# Altium schematic sheet sens_adc.SchDoc
size A
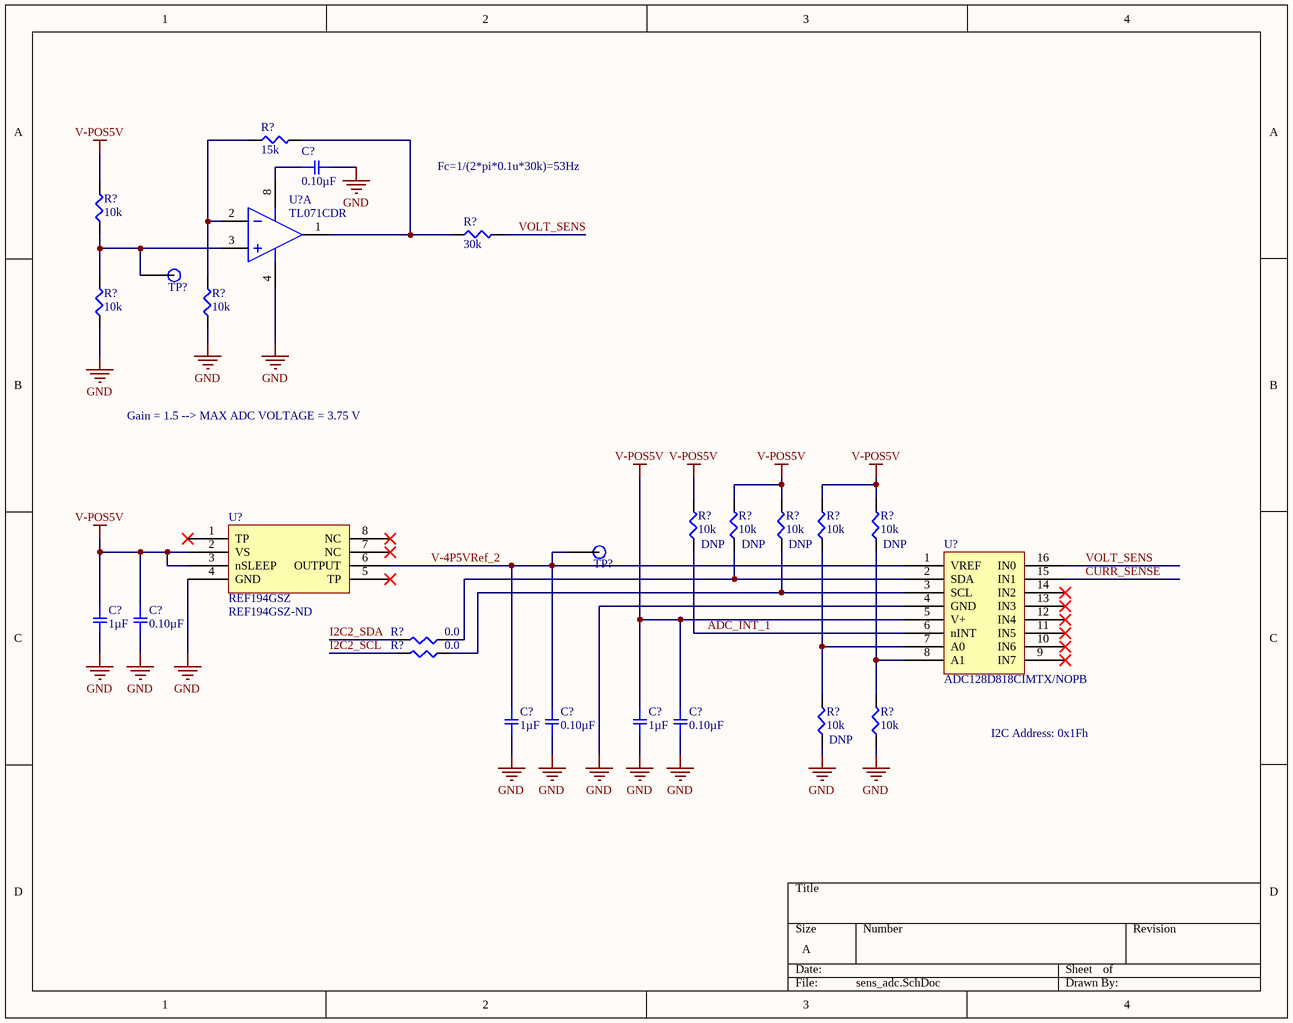
[diagram p0: sens_adc.SchDoc]

## Parts
(Parts that share a designator on the sheet are numbered #1, #2 ... from top to bottom, then left to right.)
C?#1  0.10µF  [SMD-0805C]
C?#2  1µF  [SMD-0805C]
C?#3  0.10µF  [SMD-0805C]
C?#4  1µF  [SMD-0805C]
C?#5  0.10µF  [SMD-0805C]
C?#6  1µF  [SMD-0805C]
C?#7  0.10µF  [SMD-0805C]
R?#1  15k  [SMD-0805-RES]
R?#2  10k  [SMD-0805-RES]
R?#3  30k  [SMD-0805-RES]
R?#4  10k  [SMD-0805-RES]
R?#5  10k  [SMD-0805-RES]
R?#6  10k  [SMD-0805-RES]
R?#7  10k  [SMD-0805-RES]
R?#8  10k  [SMD-0805-RES]
R?#9  10k  [SMD-0805-RES]
R?#10  10k  [SMD-0805-RES]
R?#11  0.0  [SMD-0805-RES]
R?#12  0.0  [SMD-0805-RES]
R?#13  10k  [SMD-0805-RES]
R?#14  10k  [SMD-0805-RES]
TP?#1  TP  [Test Point]  (value not drawn)
TP?#2  TP  [Test Point]  (value not drawn)
U?#1  TL071CDR  [SOP127P600X175-8N]  (part A of 2)
U?#2  REF194GSZ  Supplier Part Number 1: REF194GSZ-ND  [SOP127P600X175-8N]
U?#3  ADC128D818CIMTX/NOPB  [TSOP65P660X120-16N]

## Nets
GND: C?#1.2 C?#2.2 C?#3.2 C?#4.2 C?#5.2 C?#6.2 C?#7.2 R?#4.1 R?#5.1 R?#13.1 R?#14.1 U?#1.4(V-) U?#2.4(GND) U?#3.4(GND)
V-POS5V: C?#2.1 C?#3.1 C?#6.1 C?#7.1 R?#2.2 R?#6.2 R?#7.2 R?#8.2 R?#9.2 R?#10.2 U?#2.2(VS) U?#2.3(nSLEEP) U?#3.5(V+)
ADC_INT_1: R?#6.1 U?#3.6(nINT)
CURR_SENSE: U?#3.15(IN1)
I2C2_SCL: R?#12.2
I2C2_SDA: R?#11.2
V-4P5VRef_2: C?#4.1 C?#5.1 TP?#2.1 U?#2.6(OUTPUT) U?#3.1(VREF)
VOLT_SENS: R?#3.2 U?#3.16(IN0)
NetC?#1_1: C?#1.1 U?#1.8(V+)
NetR?#1_1: R?#1.1 R?#5.2 U?#1.2(IN-)
NetR?#1_2: R?#1.2 R?#3.1 U?#1.1(OUT)
NetR?#2_1: R?#2.1 R?#4.2 TP?#1.1 U?#1.3(IN+)
NetR?#7_1: R?#7.1 R?#11.1 U?#3.2(SDA)
NetR?#8_1: R?#8.1 R?#12.1 U?#3.3(SCL)
NetR?#9_1: R?#9.1 R?#13.2 U?#3.7(A0)
NetR?#10_1: R?#10.1 R?#14.2 U?#3.8(A1)

Not connected (* = marked no-connect by the designer): U?#2 1(TP)* 5(TP)* 7(NC)* 8(NC)*; U?#3 9(IN7)* 10(IN6)* 11(IN5)* 12(IN4)* 13(IN3)* 14(IN2)*

## Notes on the sheet
- Fc=1/(2*pi*0.1u*30k)=53Hz
- Gain = 1.5 --> MAX ADC VOLTAGE = 3.75 V
- I2C Address: 0x1Fh

## Library data of the parts
C?#1 = GRM21B7U1A104JA01L: CAP CER 0.1UF 10V U2J 0805; Manufacturer: Murata Electronics North America; Factory Stock: 0; Unit Price (USD): 0.4; Minimum Quantity: 1; Tolerance: ±5%; Datasheets: http://www.murata.com/~/media/webrenewal/support/library/catalog/products/capacitor/mlcc/c02e.pdf; Image: //media.digikey.com/Renders/Murata%20Renders/0805%20(2012%20Metric)%20.85mm.jpg; Digi-Key Part Number: 490-11592-1-ND; Part Number: GRM21B7U1A104JA01L; Quantity Available: 3390; @ qty: 0; Packaging: Cut Tape (CT); Series: GRM; Part Status: Active; Value: 0.10µF; Voltage: 10V; Temperature Coefficient: U2J; Operating Temperature: -55°C ~ 125°C; Features: -; Ratings: -; Applications: General Purpose; Mounting Type: Surface Mount, MLCC; Package / Case: 0805 (2012 Metric); Size / Dimension: 0.079" L x 0.049" W (2.00mm x 1.25mm); Height - Seated (Max): -; Thickness (Max): 0.053" (1.35mm); Lead Spacing: -; Lead Style: -
C?#2 C?#4 C?#6 = GRM21BR71H105KA12L: CAP CER 1UF 50V X7R 0805; Manufacturer: Murata Electronics North America; Factory Stock: 0; Unit Price (USD): 0.25; Minimum Quantity: 1; Tolerance: ±10%; Datasheets: http://www.murata.com/~/media/webrenewal/support/library/catalog/products/capacitor/mlcc/c02e.pdf; Image: //media.digikey.com/Renders/Murata%20Renders/0805%20(2012%20Metric)%20.85mm.jpg; Digi-Key Part Number: 490-4736-1-ND; Part Number: GRM21BR71H105KA12L; Quantity Available: 988032; @ qty: 0; Packaging: Cut Tape (CT); Series: GRM; Part Status: Active; Value: 1µF; Voltage: 50V; Temperature Coefficient: X7R; Operating Temperature: -55°C ~ 125°C; Features: -; Ratings: -; Applications: General Purpose; Mounting Type: Surface Mount, MLCC; Package / Case: 0805 (2012 Metric); Size / Dimension: 0.079" L x 0.049" W (2.00mm x 1.25mm); Height - Seated (Max): -; Thickness (Max): 0.053" (1.35mm); Lead Spacing: -; Lead Style: -
C?#3 C?#5 C?#7 = GCD21BR71H104KA01L: CAP CER 0.1UF 50V X7R 0805; Manufacturer: Murata Electronics North America; Factory Stock: 0; Unit Price (USD): 0.24; Minimum Quantity: 1; Tolerance: ±10%; Datasheets: http://www.murata.com/~/media/webrenewal/support/library/catalog/products/capacitor/mlcc/c03e.ashx; Image: //media.digikey.com/Renders/Murata%20Renders/0805%28GxM6%29.jpg; Digi-Key Part Number: 490-11955-1-ND; Part Number: GCD21BR71H104KA01L; Quantity Available: 157; @ qty: 0; Packaging: Cut Tape (CT); Series: GCD; Part Status: Active; Value: 0.10µF; Voltage: 50V; Temperature Coefficient: X7R; Operating Temperature: -55°C ~ 125°C; Features: -; Ratings: AEC-Q200; Applications: Automotive; Mounting Type: Surface Mount, MLCC; Package / Case: 0805 (2012 Metric); Size / Dimension: 0.079" L x 0.049" W (2.00mm x 1.25mm); Height - Seated (Max): -; Thickness (Max): 0.049" (1.25mm); Lead Spacing: -; Lead Style: -
R?#1 = ERJ-P06J153V: RES SMD 15K OHM 5% 1/2W 0805; Manufacturer: Panasonic Electronic Components; Factory Stock: 0; Unit Price (USD): 0.01839; @ qty: 1500; Minimum Quantity: 1; Power (Watts): 0.5W, 1/2W; Temperature Coefficient: ±200ppm/°C; Part Number: ERJ-P06J153V; Datasheets: https://industrial.panasonic.com/cdbs/www-data/pdf/RDA0000/AOA0000C243.pdf; Image: //media.digikey.com/Renders/Panasonic%20Renders/ERJ-0805%20Pkg.jpg; Digi-Key Part Number: P15KADCT-ND; Quantity Available: 18476; Packaging: Cut Tape (CT); Series: ERJ; Part Status: Active; Value: 15k; Tolerance: ±5%; Composition: Thick Film; Features: Automotive AEC-Q200, Pulse Withstanding; Operating Temperature: -55°C ~ 155°C; Package / Case: 0805 (2012 Metric); Supplier Device Package: 0805; Size / Dimension: 0.079" L x 0.049" W (2.00mm x 1.25mm); Height - Seated (Max): 0.028" (0.70mm); Number of Terminations: 2; Failure Rate: -
R?#2 R?#4-R?#10 R?#13 R?#14 = ERJ-P06J103V: RES SMD 10K OHM 5% 1/2W 0805; Manufacturer: Panasonic Electronic Components; Factory Stock: 0; Unit Price (USD): 0.01839; @ qty: 1500; Minimum Quantity: 1; Power (Watts): 0.5W, 1/2W; Temperature Coefficient: ±200ppm/°C; Part Number: ERJ-P06J103V; Datasheets: https://industrial.panasonic.com/cdbs/www-data/pdf/RDA0000/AOA0000C243.pdf; Image: //media.digikey.com/Renders/Panasonic%20Renders/ERJ-0805%20Pkg.jpg; Digi-Key Part Number: P10KADCT-ND; Quantity Available: 413576; Packaging: Cut Tape (CT); Series: ERJ; Part Status: Active; Value: 10k; Tolerance: ±5%; Composition: Thick Film; Features: Automotive AEC-Q200, Pulse Withstanding; Operating Temperature: -55°C ~ 155°C; Package / Case: 0805 (2012 Metric); Supplier Device Package: 0805; Size / Dimension: 0.079" L x 0.049" W (2.00mm x 1.25mm); Height - Seated (Max): 0.028" (0.70mm); Number of Terminations: 2; Failure Rate: -
  R?#6-R?#8 R?#10 R?#13: DNP: DNP
R?#3 = ERJ-P06J303V: RES SMD 30K OHM 5% 1/2W 0805; Manufacturer: Panasonic Electronic Components; Factory Stock: 0; Unit Price (USD): 0.01839; @ qty: 1500; Minimum Quantity: 1; Power (Watts): 0.5W, 1/2W; Temperature Coefficient: ±200ppm/°C; Part Number: ERJ-P06J303V; Datasheets: https://industrial.panasonic.com/cdbs/www-data/pdf/RDA0000/AOA0000C243.pdf; Image: //media.digikey.com/Renders/Panasonic%20Renders/ERJ-0805%20Pkg.jpg; Digi-Key Part Number: P30KADCT-ND; Quantity Available: 7773; Packaging: Cut Tape (CT); Series: ERJ; Part Status: Active; Value: 30k; Tolerance: ±5%; Composition: Thick Film; Features: Automotive AEC-Q200, Pulse Withstanding; Operating Temperature: -55°C ~ 155°C; Package / Case: 0805 (2012 Metric); Supplier Device Package: 0805; Size / Dimension: 0.079" L x 0.049" W (2.00mm x 1.25mm); Height - Seated (Max): 0.028" (0.70mm); Number of Terminations: 2; Failure Rate: -
R?#11 R?#12 = ERJ-6GEY0R00V: RES SMD 0.0 OHM JUMPER 1/8W 0805; Manufacturer: Panasonic Electronic Components; Factory Stock: 0; Unit Price (USD): 0.00544; @ qty: 1500; Minimum Quantity: 1; Power (Watts): 0.125W, 1/8W; Part Number: ERJ-6GEY0R00V; Datasheets: http://industrial.panasonic.com/www-cgi/jvcr13pz.cgi?E+PZ+3+AOA0001+ERJ6GEY0R00V+7+WW; Image: //media.digikey.com/Renders/Panasonic%20Renders/ERJ-0805%20Pkg.jpg; Digi-Key Part Number: P0.0ACT-ND; Quantity Available: 1597627; Packaging: Cut Tape (CT); Series: ERJ; Part Status: Active; Value: 0.0; Tolerance: Jumper; Composition: Thick Film; Features: Automotive AEC-Q200; Temperature Coefficient: -; Operating Temperature: -55°C ~ 155°C; Package / Case: 0805 (2012 Metric); Supplier Device Package: 0805; Size / Dimension: 0.079" L x 0.049" W (2.00mm x 1.25mm); Height - Seated (Max): 0.028" (0.70mm); Number of Terminations: 2; Failure Rate: -
TP?#1 TP?#2 = TP: SMD TEST POINT
U?#1 = TL071CDR: IC OPAMP JFET 3MHZ 8SOIC; Manufacturer: Texas Instruments; Max Dual Supply Voltage: 18V; Voltage Gain: 106.02dB; Common Mode Rejection Ratio: 70dB; Slew Rate: 13V/µs; Input Offset Voltage (Vos): 10mV; Input Bias Current: 200pA; Number of Elements: 1; Nominal Supply Current: 2.5mA; Min Dual Supply Voltage: 3.5V; Operating Supply Current: 1.4mA; Dual Supply Voltage: 9V; Supplier 1: Digi-Key; Manufacturer Part Number: TL071CDR; Stock 1: 8447; Pricing 1: 1=0.47000, 10=0.40200, 100=0.29990, 500=0.23566, 1000=0.18210 (USD); RoHS: Yes; Case/Package: D; Number of Pins: 8; Contact Plating: Gold; Min Operating Temperature: -40°C; Max Operating Temperature: 85°C; Packaging: Tape and Reel; Unity Gain Bandwidth Product: 3MHz; Bandwidth: 3MHz; Package Quantity: 1; Nominal Gain Bandwidth Product: 3MHz; Number of Channels: 1; Max I/O Voltage: 10mV; Gain Bandwidth Product: 3MHz; Number of Circuits: 1; Max Supply Voltage: 18V; Number of Amplifiers: 1; Length: 4.9mm; Height: 1.58mm; Width: 3.91mm; Radiation Hardening: No; Lead Free: Lead Free; REACH SVHC: No SVHC; ComponentLink1URL: https://datasheet.ciiva.com/46439/1835036-46439448.pdf?src-supplier=Element14; ComponentLink1Description: https://datasheet.ciiva.com/46439/1835036-46439448.pdf?src-supplier=Element14; ComponentLink2URL: https://datasheet.ciiva.com/1795/tl071a-1795709.pdf?src-supplier=Digi-Key; ComponentLink2Description: https://datasheet.ciiva.com/1795/tl071a-1795709.pdf?src-supplier=Digi-Key; ComponentLink3URL: https://datasheet.ciiva.com/14456/tl074-14456719.pdf?src-supplier=Avnet; ComponentLink3Description: https://datasheet.ciiva.com/14456/tl074-14456719.pdf?src-supplier=Avnet; ComponentLink4URL: https://datasheet.ciiva.com/26243/tl074-26243627.pdf?src-supplier=Avnet+Europe; ComponentLink4Description: https://datasheet.ciiva.com/26243/tl074-26243627.pdf?src-supplier=Avnet+Europe; ComponentLink5URL: https://datasheet.ciiva.com/1795/tl071a-1795710.pdf?src-supplier=Digi-Key; ComponentLink5Description: https://datasheet.ciiva.com/1795/tl071a-1795710.pdf?src-supplier=Digi-Key; ComponentLink6URL: https://datasheet.ciiva.com/1795/tl071a-1795711.pdf?src-supplier=Digi-Key; ComponentLink6Description: https://datasheet.ciiva.com/1795/tl071a-1795711.pdf?src-supplier=Digi-Key; Supplier Part Number 1: 296-14994-1-ND
U?#2 = REF194GSZ: IC VREF SERIES 4.5V 8SOIC; Manufacturer: Analog Devices; Max Input Voltage: 18V; Max Output Current: 30mA; Temperature Coefficient: 25ppm/°C; Number of Channels: 1; Min Output Voltage: 4.49V; Operating Supply Current: 45uA; Quiescent Current: 15uA; Min Input Voltage: 4.75V; Supplier 1: Digi-Key; Manufacturer Part Number: REF194GSZ; Stock 1: 359; Pricing 1: 1=3.56000, 10=3.19700, 25=3.02240, 100=2.61940, 250=2.48512, 500=2.22988, 1000=1.88062, 2500=1.78659 (USD); RoHS: Yes; Case/Package: R; Number of Pins: 8; Min Operating Temperature: -40°C; Max Operating Temperature: 85°C; Output Voltage: 4.5V; Packaging: Rail/Tube; Output Current: 30mA; Max Output Voltage: 4.5V; Reference Type: Series; Package Quantity: 98; Nominal Supply Current: 45uA; Reference Voltage: 4.5V; Length: 5mm; Height: 1.5mm; Width: 4mm; Radiation Hardening: No; Lead Free: Contains Lead; REACH SVHC: No SVHC; ComponentLink1URL: https://datasheet.ciiva.com/17219/ref19xseries-17219157.pdf?src-supplier=Avnet+Europe; ComponentLink1Description: https://datasheet.ciiva.com/17219/ref19xseries-17219157.pdf?src-supplier=Avnet+Europe; ComponentLink2URL: https://datasheet.ciiva.com/22666/1506113-22666153.pdf?src-supplier=Element14; ComponentLink2Description: https://datasheet.ciiva.com/22666/1506113-22666153.pdf?src-supplier=Element14; ComponentLink3URL: https://datasheet.ciiva.com/2005/ref19xseries-2005902.pdf?src-supplier=Digi-Key; ComponentLink3Description: https://datasheet.ciiva.com/2005/ref19xseries-2005902.pdf?src-supplier=Digi-Key; ComponentLink4URL: https://datasheet.ciiva.com/3235/ref19xseries-3235518.pdf?src-supplier=Avnet; ComponentLink4Description: https://datasheet.ciiva.com/3235/ref19xseries-3235518.pdf?src-supplier=Avnet
U?#3 = ADC128D818CIMTX/NOPB: Analog to Digital Converters - ADC; Manufacturer: TI National Semiconductor; Resolution: 12b; Sampling Rate: 10000S/s; Number of A/D Converters: 1; Polarity: Unipolar; Max Supply Voltage: 5.5V; Min Supply Voltage: 3V; Interface: I2C; Number of Channels: 8; Max Power Dissipation: 33mW; Number of Converters: 4; Number of Bits: 12; Integral Nonlinearity (INL): -2LSB; Supply Type: Analog,Digital,Single; Power Consumption: 2mW; Power Dissipation: 2.01mW; Differential Nonlinearity: 1LSB; Supplier 1: Digi-Key; Manufacturer Part Number: ADC128D818CIMTX/NOPB; Stock 1: 21177; Pricing 1: 1=4.68000, 10=4.20700, 100=3.44660, 500=2.93402, 1000=2.47447 (USD); RoHS: Yes; Mount: Surface Mount; Case/Package: TSSOP; Number of Pins: 16; Contact Plating: Tin,Matte; Min Operating Temperature: -40°C; Max Operating Temperature: 125°C; Packaging: Tape and Reel; Package Quantity: 2500; Number of Inputs: 8; Number of Elements: 1; Radiation Hardening: No; Lead Free: Lead Free; ComponentLink1URL: https://datasheet.ciiva.com/14259/adc128d818-14259977.pdf?src-supplier=Avnet; ComponentLink1Description: https://datasheet.ciiva.com/14259/adc128d818-14259977.pdf?src-supplier=Avnet; Supplier Part Number 1: 296-41182-1-ND